# Altium schematic sheet Power_Management.SchDoc: Power Management
size A4; Author: Ph.A; SheetNumber: 5; SheetTotal: 6
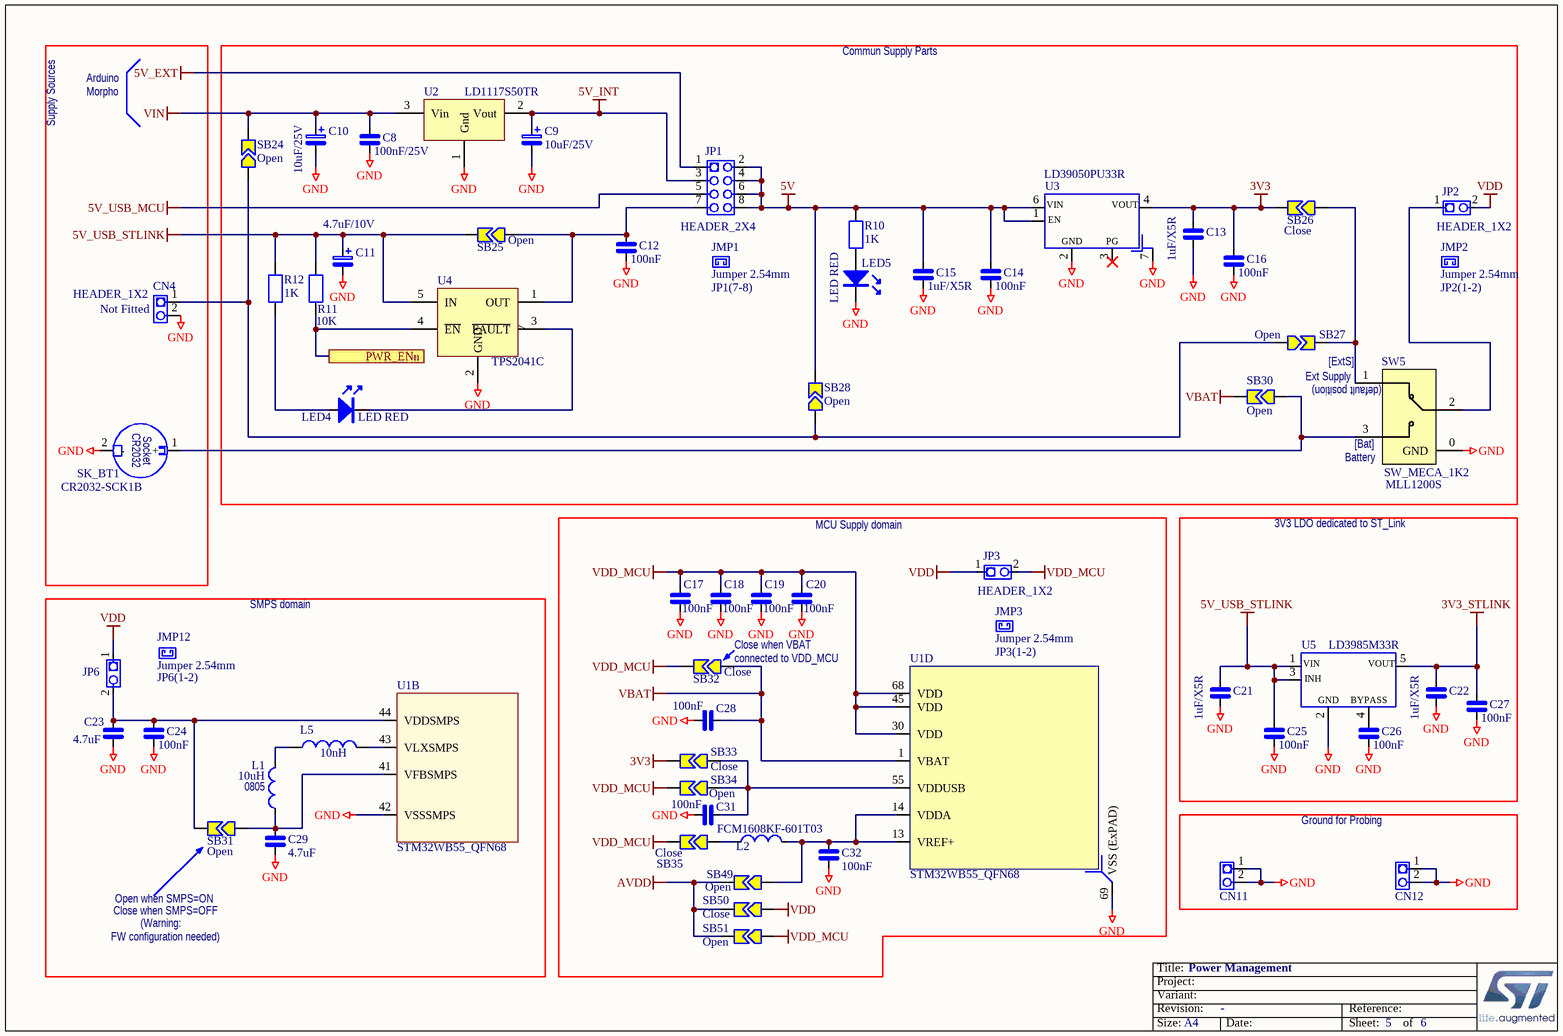
[diagram p0: Power_Management.SchDoc]

## Parts
C8  100nF/25V  [0402_CAP_NPOL]
C9  10uF/25V  [1210_CAP_POL]
C10  10uF/25V  [1210_CAP_POL]
C11  4.7uF/10V  [1210_CAP_POL]
C12  100nF  [0402_CAP_NPOL]
C13  1uF/X5R  [0603_CAP_NPOL]
C14  100nF  [0402_CAP_NPOL]
C15  1uF/X5R  [0603_CAP_NPOL]
C16  100nF  [0402_CAP_NPOL]
C17  100nF  [0402_CAP_NPOL]
C18  100nF  [0402_CAP_NPOL]
C19  100nF  [0402_CAP_NPOL]
C20  100nF  [0402_CAP_NPOL]
C21  1uF/X5R  [0603_CAP_NPOL]
C22  1uF/X5R  [0603_CAP_NPOL]
C23  4.7uF  [0402_CAP_NPOL]
C24  100nF  [0402_CAP_NPOL]
C25  100nF  [0402_CAP_NPOL]
C26  100nF  [0402_CAP_NPOL]
C27  100nF  [0402_CAP_NPOL]
C28  100nF  [0402_CAP_NPOL]
C29  4.7uF  [0402_CAP_NPOL]
C31  100nF  [0402_CAP_NPOL]
C32  100nF  [0402_CAP_NPOL]
CN4  HEADER_1X2  Fitted: Not Fitted  [Header NF 1x2x2.54 TH]
CN11  HEADER_1X2  [Header M 1x2x2.54 TH V]  (value not drawn)
CN12  HEADER_1X2  [Header M 1x2x2.54 TH V]  (value not drawn)
JMP1  Jumper 2.54mm  Default: JP1(7-8)  [Jumper 2.54mm BLACK]
JMP2  Jumper 2.54mm  Default: JP2(1-2)  [Jumper 2.54mm BLACK]
JMP3  Jumper 2.54mm  default: JP3(1-2)  [Jumper 2.54mm BLACK]
JMP12  Jumper 2.54mm  default: JP6(1-2)  [Jumper 2.54mm BLACK]
JP1  HEADER_2X4  [Header M 2x4x2.54 TH V]
JP2  HEADER_1X2  [Header M 1x2x2.54 TH V]
JP3  HEADER_1X2  [Header M 1x2x2.54 TH V]
JP6  HEADER_1X2  [Header M 1x2x2.54 TH V]  (value not drawn)
L1  10uH  [0805_COIL]
L2  FCM1608KF-601T03  [0603_COIL]
L5  value 10nH  [IND_0402_MURATA_LQW15AN_H0P5]  (hidden comment: Inductor)
LED4  LED RED  [0603_LED_RED]
LED5  LED RED  [0603_LED_RED]
R10  1K  [0402_RES]
R11  10K  [0402_RES]
R12  1K  [0402_RES]
SB24  Open  [SB-tiny]
SB25  Open  [SB-tiny]
SB26  Close  [SB-tiny]
SB27  Open  [SB-tiny]
SB28  Open  [SB-tiny]
SB30  Open  [SB-tiny]
SB31  Open  [SB-tiny]
SB32  Close  [SB-tiny]
SB33  Close  [SB-tiny]
SB34  Open  [SB-tiny]
SB35  Close  [SB-tiny]
SB49  Open  [SB-tiny]
SB50  Close  [SB-tiny]
SB51  Open  [SB-tiny]
SK_BT1  CR2032-SCK1B  [CR2032-SCK1]
SW5  SW_MECA_1K2  value MLL1200S  [SWI_SPDT-RA_TE-CONNECTIVITY_MLL1200S_1P2T]
U1  STM32WB55_QFN68  [VFQFPN68_8x8x0.1_p0.4]  (parts B,D of 5)
U2  LD1117S50TR  [SOT223_SC73_A]
U3  LD39050PU33R  [DFN6 3x3mm]
U4  TPS2041C  [MOS_SOT23-5L]
U5  LD3985M33R  [SOT23-5]

## Blocks framed on the sheet
3V3 LDO dedicated to ST_Link: C21 C22 C25-C27 U5
Ground for Probing: CN11 CN12

## Ports
PWR_ENn

## Nets
3V3: C13.1 C16.1 SB26.2 SB33.2 U3.4(VOUT)
3V3_STLINK: C22.1 C27.1 U5.5(VOUT)
5V: C14.1 C15.1 JP1.2 JP1.4 JP1.6 JP1.8 R10.1 SB28.2 U3.1(EN) U3.6(VIN)
5V_EXT: JP1.1
5V_INT: C9.1 JP1.3 U2.2(Vout)
5V_USB_MCU: JP1.5
5V_USB_STLINK: C11.1 C21.1 C25.1 R11.1 R12.1 SB25.2 U4.5(IN) U5.1(VIN) U5.3(CE)
AVDD: SB49.2 SB50.2 SB51.2
GND: C8.2 C9.2 C10.2 C11.2 C12.2 C13.2 C14.2 C15.2 C16.2 C17.2 C18.2 C19.2 C20.2 C21.2 C22.2 C23.2 C24.2 C25.2 C26.2 C27.2 C28.2 C29.2 C31.2 C32.2 CN4.2 CN11.1 CN11.2 CN12.1 CN12.2 LED5.K SK_BT1.2(-) SW5.0(GND) U1.42(VSSSMPS) U1.69(VSS_(ExPAD)) U2.1(Gnd) U3.2(VSS) U3.7 U4.2(GND) U5.2(VSS)
VBAT: C28.1 SB30.2 SB32.1 U1.1(VBAT)
VDD: JP2.2 JP3.1 JP6.1 SB50.1
VDD_MCU: C17.1 C18.1 C19.1 C20.1 JP3.2 SB32.2 SB34.2 SB35.2 SB51.1 U1.30(VDD) U1.45(VDD) U1.68(VDD)
VIN: C8.1 C10.1 SB24.2 U2.3(Vin)
PWR_ENn: R11.2 U4.4(~{EN}) ; port PWR_ENn
NetC12_1: C12.1 JP1.7 SB25.1 U4.1(OUT)
NetC23_1: C23.1 C24.1 JP6.2 SB31.2 U1.44(VDDSMPS)
NetC26_1: C26.1 U5.4(BYPASS)
NetC29_1: C29.1 L1.1 SB31.1 U1.41(VFBSMPS)
NetC31_1: C31.1 SB33.1 SB34.1 U1.55(VDDUSB)
NetC32_1: C32.1 L2.2 SB49.1 U1.13(VREF+) U1.14(VDDA)
NetCN4_1: CN4.1 SB24.1 SB27.1 SB28.1
NetJP2_1: JP2.1 SW5.2
NetL1_2: L1.2 L5.1
NetL2_1: L2.1 SB35.1
NetL5_2: L5.2 U1.43(VLXSMPS)
NetLED4_A: LED4.A R12.2
NetLED4_K: LED4.K U4.3(~{FAULT})
NetLED5_A: LED5.A R10.2
NetSB26_1: SB26.1 SB27.2 SW5.1
NetSB30_1: SB30.1 SK_BT1.1(+) SW5.3

Not connected (* = marked no-connect by the designer): U3 3(PG)*

## Notes on the sheet
- Arduino
- Morpho
- Commun Supply Parts
- Supply Sources
- Ext Supply
- [ExtS]
- (default position)
- (near SW5) [Bat]
- (near SW5) Battery
- MCU Supply domain
- SMPS domain
- (near SB32) Close when VBAT
- (near SB32) connected to VDD_MCU
- (near L1) 0805
- Close when SMPS=OFF
- Open when SMPS=ON
- FW configuration needed)
- (Warning:
- Title:
- Project:
- Size:
- Revision:
- Variant:
- A4
- -
- Date:
- Reference:
- Sheet:
- of
- (in symbol CR2032-SCK1B) CR2032; Socket
- (in symbol LD3985M33R) INH; GND
- (in symbol LD39050PU33R) GND

## Library data of the parts
C8 C12-C29 C31 C32 = CAP_NPOL: Capacitor_not polarized
C9-C11 = CAP_POL: Condensateur_polarise
JP2 JP3 JP6 = HEADER_1X2_L
L1 = IND_74479777310A: Coil Wurtz 10uH ref: 74479777310A
L2 = IND_FCM1608KF-601T03
L5 = MCD-02063: inductor, 10nH +-2%, 100mA max,1.3 ohm DC max, Q min = 13,0402; Manufacturer_Part_Number: LQP15MN10NG02; Manufacturer: MURATA; ECCN_US: EAR99; ECCN_EU: NEC; Provided_By: SUBCO; Order_Code_RS: 167-3827; Internal_Part_Number: MCD-02063; Status: Checked; Part_Type: Inductor; Package: L0402; ComponentLink1Description: Datasheet; ComponentLink1URL: http://tunmcdsvn.tun.st.com/Component_Datasheet_Library/Trunk/Inductors/Murata_inductor_LQP15MN10NG02/Murata_inductor_LQP15MN10NG02.pdf; Alternate_Manufacturer_Part_Number: N/A; Alternate_Manufacturer: N/A; Order_Code_Digikey: 490-6743-1-ND; Order_Code_Farnell: 1762617
LED4 LED5 = LED: Light-Emitting Diode; Part Number A: *
R10-R12 = RES: Resistor
SB24-SB28 SB30-SB35 SB49-SB51 = Strap2: Solder Jumper; Solder: YES; Published: 24-Mar-1999; Revision: July-2002: Re-released for DXP Platform.; Publisher: Altium Limited
SW5 = MCD-02081: SPDT RA SMT SLIDE SWITCH; Part_Type: Connector; Manufacturer: TE_Connectivity; ECCN_US: EAR99; ECCN_EU: NEC; Provided_By: SUBCO; Internal_Part_Number: MCD-02081; Status: Checked; Manufacturer_Part_Number: MLL1200S; ComponentLink1Description: Datasheet; ComponentLink1URL: http://tunmcdsvn.tun.st.com/Component_Datasheet_Library/Trunk/Connectors/TE_Connectivity_MLL1200S/TE_MLL1200S.pdf
U1 = STM32WBxx_QFN68
U2 = LD1117S50TR: IC REG LDO 5V 0.8A SOT223; Manuf_1: STM; ECCN_US/EU: EAR99/NEC; Ref St: 9176133; Fitted: YES; Manuf_Part_1: LD1117S50TR; Distrib: STM; Ordered_By: STM; Order_code: LD1117S50TR; Value: LD1117S50TR
U3 = LD39050PU33R: 3.3V voltage regulator 500mA
U4 = MCD-01785: 5V Power Switch, 0.85A, RDSon 130mOhm max, with active low enable pin; Part_Type: IC; Manufacturer_Part_Number: TPS2041CDBVT; Manufacturer: TEXAS INSTRUMENTS; ECCN_US: EAR99; ECCN_EU: NEC; Provided_By: SUBCO; Internal_Part_Number: MCD-01785; Value: TPS2041C; Status: Checked; Package: SOT23_5p; ComponentLink1Description: Datasheet; ComponentLink1URL: http://tunmcdsvn.tun.st.com/Component_Datasheet_Library/Trunk/IC/TI_PWR_SWITCH_5V_TPS20xxC
U5 = LD3985M33R: 3.3V low drop voltage regulator; Manufacturer: STMicroelectronics; Isortie max: 550mA; V entrée max: 6V; Manufacturer P/N: LD3985M33R; Order code Farnell: *; V sortie Typ. V: 3.3V; Temperature Max: +125°C; Type: Fixed; Temperature Min: -40°C